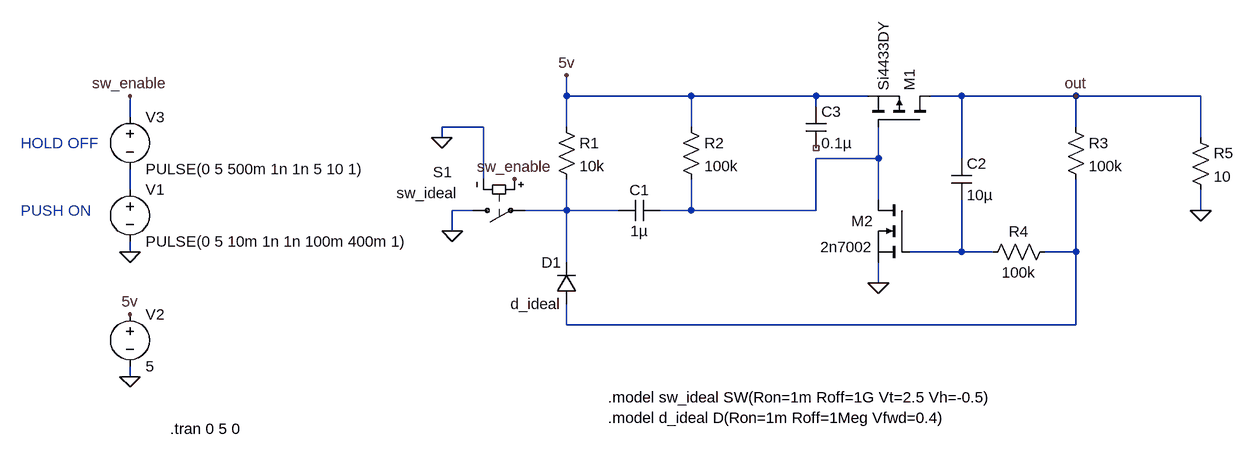
[diagram p0: schematic push_on_hold_off_tran.asc]
push_on_hold_off_tran.asc, the LTspice schematic file:
Version 4
SHEET 1 1144 680
WIRE 112 48 112 16
WIRE 304 48 112 48
WIRE 496 48 304 48
WIRE 576 48 496 48
WIRE 720 48 672 48
WIRE 896 48 720 48
WIRE 1088 48 896 48
WIRE 496 64 496 48
WIRE -560 80 -560 48
WIRE -16 96 -80 96
WIRE 112 96 112 48
WIRE 304 96 304 48
WIRE 896 96 896 48
WIRE -80 112 -80 96
WIRE 1088 112 1088 48
WIRE 592 144 592 96
WIRE 592 144 496 144
WIRE 720 144 720 48
WIRE -16 176 -16 96
WIRE -560 192 -560 160
WIRE 592 208 592 144
WIRE -32 224 -64 224
WIRE 112 224 112 176
WIRE 112 224 48 224
WIRE 192 224 112 224
WIRE 304 224 304 176
WIRE 304 224 256 224
WIRE 496 224 496 144
WIRE 496 224 304 224
WIRE 1088 224 1088 192
WIRE -64 256 -64 224
WIRE -560 288 -560 272
WIRE 720 288 720 208
WIRE 720 288 640 288
WIRE 768 288 720 288
WIRE 896 288 896 176
WIRE 896 288 848 288
WIRE 112 304 112 224
WIRE 592 336 592 304
WIRE 112 400 112 368
WIRE 896 400 896 288
WIRE 896 400 112 400
WIRE -560 480 -560 464
FLAG -64 256 0
FLAG -80 112 0
FLAG 32 176 sw_enable
FLAG -560 288 0
FLAG -560 48 sw_enable
FLAG 112 16 5v
FLAG -560 480 0
FLAG -560 384 5v
FLAG 896 48 out
FLAG 592 336 0
FLAG 1088 224 0
SYMBOL res 96 80 R0
SYMATTR InstName R1
SYMATTR Value 10k
SYMBOL res 288 80 R0
SYMATTR InstName R2
SYMATTR Value 100k
SYMBOL cap 256 208 R90
WINDOW 0 0 32 VBottom 2
WINDOW 3 32 32 VTop 2
SYMATTR InstName C1
SYMATTR Value 1µ
SYMBOL diode 128 368 R180
WINDOW 0 24 64 Left 2
WINDOW 3 24 0 Left 2
SYMATTR InstName D1
SYMATTR Value d_ideal
SYMBOL pmos 672 96 M270
SYMATTR InstName M1
SYMATTR Value Si4433DY
SYMBOL nmos 640 208 M0
SYMATTR InstName M2
SYMATTR Value 2n7002
SYMBOL res 880 80 R0
SYMATTR InstName R3
SYMATTR Value 100k
SYMBOL res 864 272 R90
WINDOW 0 0 56 VBottom 2
WINDOW 3 32 56 VTop 2
SYMATTR InstName R4
SYMATTR Value 100k
SYMBOL cap 704 144 R0
SYMATTR InstName C2
SYMATTR Value 10µ
SYMBOL sw -48 224 M90
WINDOW 0 -59 -16 VLeft 2
WINDOW 3 -27 -8 VLeft 2
SYMATTR InstName S1
SYMATTR Value sw_ideal
SYMBOL voltage -560 176 R0
WINDOW 123 0 0 Left 0
WINDOW 39 0 0 Left 0
SYMATTR InstName V1
SYMATTR Value PULSE(0 5 10m 1n 1n 100m 400m 1)
SYMBOL voltage -560 368 R0
SYMATTR InstName V2
SYMATTR Value 5
SYMBOL res 1072 96 R0
SYMATTR InstName R5
SYMATTR Value 10
SYMBOL cap 480 64 R0
SYMATTR InstName C3
SYMATTR Value 0.1µ
SYMBOL voltage -560 64 R0
WINDOW 123 0 0 Left 0
WINDOW 39 0 0 Left 0
SYMATTR InstName V3
SYMATTR Value PULSE(0 5 500m 1n 1n 5 10 1)
TEXT 176 512 Left 2 !.model sw_ideal SW(Ron=1m Roff=1G Vt=2.5 Vh=-0.5)\n.model d_ideal D(Ron=1m Roff=1Meg Vfwd=0.4)
TEXT -498 560 Left 2 !.tran 0 5 0
TEXT -728 120 Left 2 ;HOLD OFF
TEXT -728 224 Left 2 ;PUSH ON

The netlist it stands for:
* push_on_hold_off_tran.asc
R1 5v N003 10k
R2 5v N001 100k
C1 N001 N003 1µ
D1 N005 N003 d_ideal
M1 out N001 5v 5v Si4433DY
M2 N001 N004 0 0 2n7002
R3 out N005 100k
R4 N005 N004 100k
C2 out N004 10µ
S1 0 N003 sw_enable 0 sw_ideal
V1 N002 0 PULSE(0 5 10m 1n 1n 100m 400m 1)
V2 5v 0 5
R5 out 0 10
C3 5v NC_01 0.1µ
V3 sw_enable N002 PULSE(0 5 500m 1n 1n 5 10 1)
.model D D
.lib standard.dio
.model NMOS NMOS
.model PMOS PMOS
.lib standard.mos
.model sw_ideal SW(Ron=1m Roff=1G Vt=2.5 Vh=-0.5)
.model d_ideal D(Ron=1m Roff=1Meg Vfwd=0.4)
.tran 0 5 0
* HOLD OFF
* PUSH ON
.backanno
.end